# EAGLE schematic senior_design (EAGLE 8.4.1)
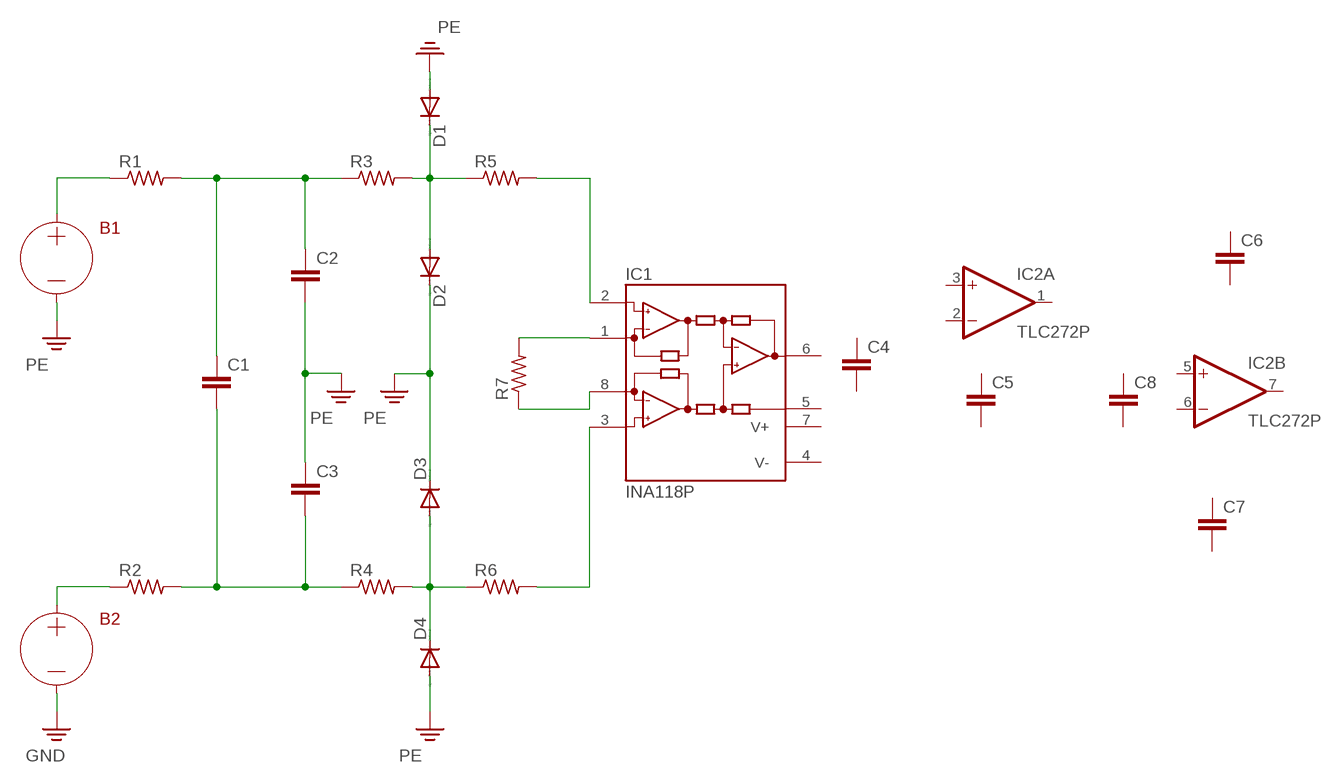
[diagram p0: schematic, sheet 1]

## Parts
B1  NONLIN_ASRC  (no package)
B2  NONLIN_ASRC  (no package)
C1  C2,5-3  [C2.5-3]
C2  C2,5-3  [C2.5-3]
C3  C2,5-3  [C2.5-3]
C4  C2,5-3  [C2.5-3]
C5  C2,5-3  [C2.5-3]
C6  C2,5-3  [C2.5-3]
C7  C2,5-3  [C2.5-3]
C8  C2,5-3  [C2.5-3]
D1  1N4148DO35-7  [DO35-7]
D2  1N4148DO35-7  [DO35-7]
D3  1N4148DO35-7  [DO35-7]
D4  1N4148DO35-7  [DO35-7]
IC1  INA118P  [DIL08]
IC2  TLC272P  [DIL08]
R1  R-US_0204/2V  [0204V]
R2  R-US_0204/2V  [0204V]
R3  R-US_0204/2V  [0204V]
R4  R-US_0204/2V  [0204V]
R5  R-US_0204/2V  [0204V]
R6  R-US_0204/2V  [0204V]
R7  R-US_0204/2V  [0204V]

## Nets
N$1: B1.+ R1.1
N$2: B2.+ R2.1
N$3: C1.1 C2.1 R1.2 R3.1
N$4: C1.2 C3.2 R2.2 R4.1
N$5: D1.C D2.A R3.2 R5.1
N$6: D3.A D4.C R4.2 R6.1
N$7: IC1.2(-IN) R5.2
N$8: IC1.3(+IN) R6.2
N$9: IC1.1(RG) R7.2
N$10: IC1.8(RG) R7.1
PE: B1.- B2.- C2.2 C3.1 D1.A D2.C D3.C D4.A ; supply symbol labelled GND
Unconnected: C4.1 C4.2 C5.1 C5.2 C6.1 C6.2 C7.1 C7.2 C8.1 C8.2 IC1.5(REF) IC1.6(OUT) IC2.1(A:OUT) IC2.2(A:-IN) IC2.3(A:+IN) IC2.5(B:+IN) IC2.6(B:-IN) IC2.7(B:OUT)

## Power pins joined to a net without a drawn wire
V+: IC1.7(V+) IC2.8(P:V+)
V-: IC1.4(V-) IC2.4(P:V-)

## Library data of the parts
B1 B2 = ngspice-simulation:NONLIN_ASRC: Nonlinear dependent source (ASRC) BXXXXXXX n+ n− < i = e x p r > <v= e x p r > < t c 1 = v al u e > < t c 2 = v al u e ><temp= v al u e > <dtemp= v al u e >
C1-C8 = capacitor-wima:C: CAPACITOR naming: grid - package width
D1-D4 = diode:1N4148: DIODE high speed (Philips)
IC1 = burr-brown:INA118: Instrumentation Amplifier Precision, Low Power; MF: TEXAS INSTRUMENTS; MPN: INA118P; OC_FARNELL: 1470354; OC_NEWARK: 96K4515
IC2 = linear:TLC272: OP AMP
R1-R7 = rcl:R-US_: RESISTOR, American symbol